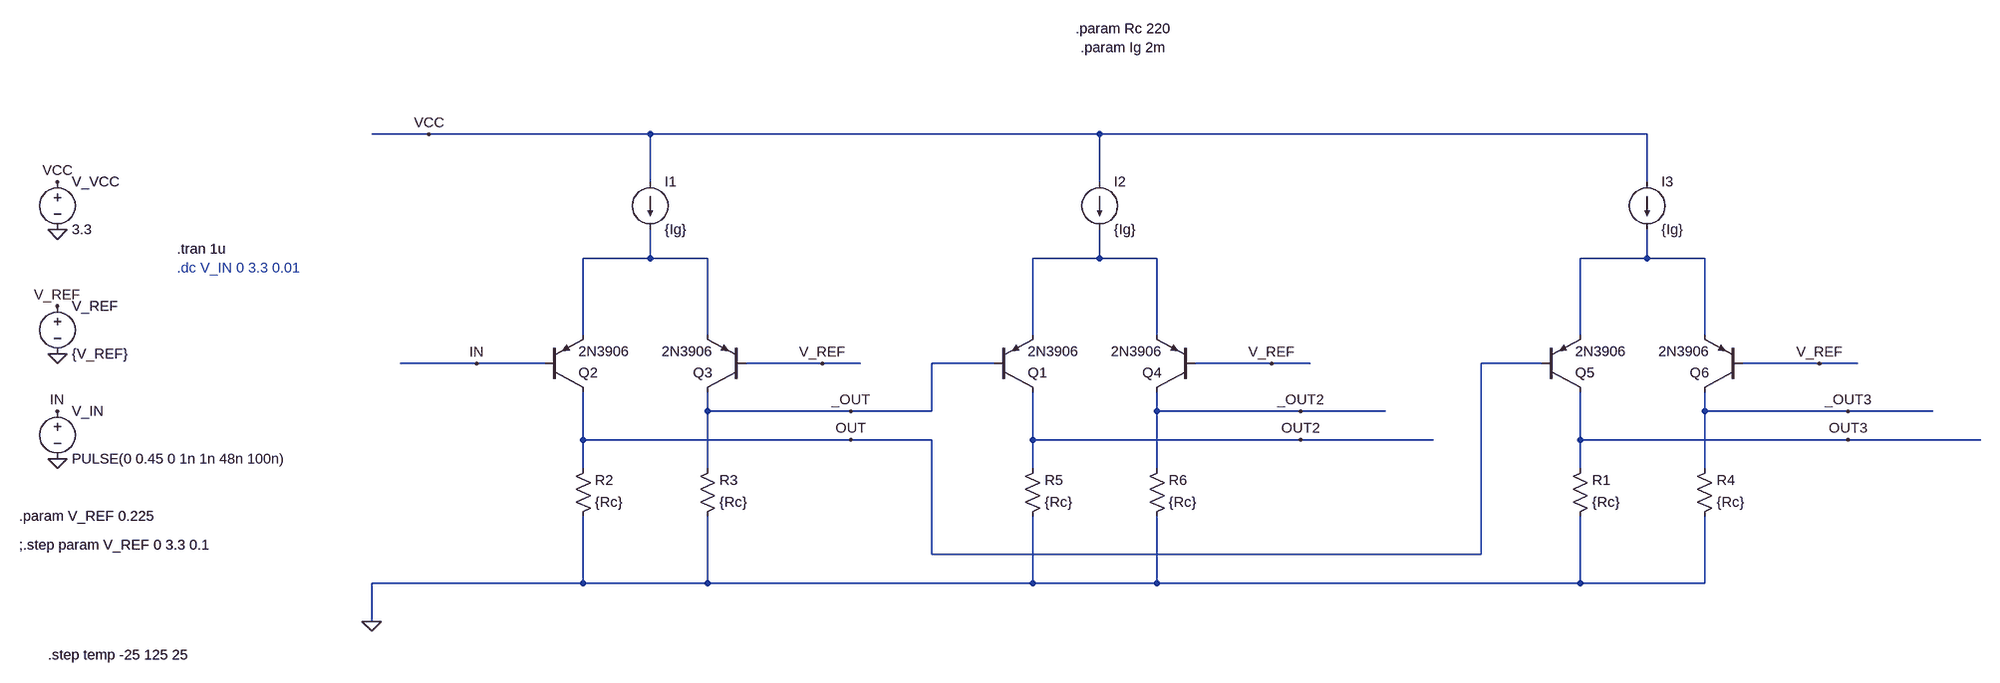
[diagram p0: schematic bm2ecl_gates.asc]
bm2ecl_gates.asc, the LTspice schematic file:
Version 4
SHEET 1 4180 740
WIRE -224 -352 -320 -352
WIRE 176 -352 -224 -352
WIRE 1168 -352 176 -352
WIRE 2144 -352 1168 -352
WIRE 176 -272 176 -352
WIRE 1168 -272 1168 -352
WIRE 2144 -272 2144 -352
WIRE 176 -144 176 -192
WIRE 176 -144 64 -144
WIRE 272 -144 176 -144
WIRE 1168 -144 1168 -192
WIRE 1168 -144 1056 -144
WIRE 1264 -144 1168 -144
WIRE 2144 -144 2144 -192
WIRE 2144 -144 2032 -144
WIRE 2240 -144 2144 -144
WIRE 64 -16 64 -144
WIRE 272 -16 272 -144
WIRE 1056 -16 1056 -144
WIRE 1264 -16 1264 -144
WIRE 2032 -16 2032 -144
WIRE 2240 -16 2240 -144
WIRE -144 32 -272 32
WIRE 0 32 -144 32
WIRE 464 32 336 32
WIRE 528 32 464 32
WIRE 992 32 832 32
WIRE 1456 32 1328 32
WIRE 1520 32 1456 32
WIRE 1968 32 1808 32
WIRE 2432 32 2304 32
WIRE 2496 32 2432 32
WIRE 272 112 272 80
WIRE 512 112 272 112
WIRE 832 112 832 32
WIRE 832 112 512 112
WIRE 1264 112 1264 80
WIRE 1504 112 1264 112
WIRE 1648 112 1504 112
WIRE 2240 112 2240 80
WIRE 2480 112 2240 112
WIRE 2624 112 2480 112
WIRE 64 160 64 80
WIRE 512 160 64 160
WIRE 832 160 512 160
WIRE 1056 160 1056 80
WIRE 1504 160 1056 160
WIRE 1728 160 1504 160
WIRE 2032 160 2032 80
WIRE 2480 160 2032 160
WIRE 2704 160 2480 160
WIRE 64 208 64 160
WIRE 272 208 272 112
WIRE 1056 208 1056 160
WIRE 1264 208 1264 112
WIRE 2032 208 2032 160
WIRE 2240 208 2240 112
WIRE 832 352 832 160
WIRE 1808 352 1808 32
WIRE 1808 352 832 352
WIRE 64 400 64 288
WIRE 64 400 -320 400
WIRE 272 400 272 288
WIRE 272 400 64 400
WIRE 1056 400 1056 288
WIRE 1056 400 272 400
WIRE 1264 400 1264 288
WIRE 1264 400 1056 400
WIRE 2032 400 2032 288
WIRE 2032 400 1264 400
WIRE 2240 400 2240 288
WIRE 2240 400 2032 400
WIRE -320 464 -320 400
FLAG -944 -192 0
FLAG -944 192 0
FLAG -944 16 0
FLAG -944 -272 VCC
FLAG -224 -352 VCC
FLAG -144 32 IN
FLAG 512 160 OUT
FLAG 512 112 _OUT
FLAG 464 32 V_REF
FLAG -944 -64 V_REF
FLAG 1504 160 OUT2
FLAG 1504 112 _OUT2
FLAG 1456 32 V_REF
FLAG -944 112 IN
FLAG -320 464 0
FLAG 2480 160 OUT3
FLAG 2480 112 _OUT3
FLAG 2432 32 V_REF
SYMBOL res 48 304 M180
WINDOW 0 36 76 Left 2
WINDOW 3 36 40 Left 2
SYMATTR InstName R2
SYMATTR Value {Rc}
SYMBOL res 256 304 M180
WINDOW 0 36 76 Left 2
WINDOW 3 36 40 Left 2
SYMATTR InstName R3
SYMATTR Value {Rc}
SYMBOL voltage -944 96 R0
WINDOW 123 0 0 Left 0
WINDOW 39 0 0 Left 0
SYMATTR InstName V_IN
SYMATTR Value PULSE(0 0.45 0 1n 1n 48n 100n)
SYMBOL voltage -944 -80 R0
SYMATTR InstName V_REF
SYMATTR Value {V_REF}
SYMBOL voltage -944 -288 R0
SYMATTR InstName V_VCC
SYMATTR Value 3.3
SYMBOL res 1040 304 M180
WINDOW 0 36 76 Left 2
WINDOW 3 36 40 Left 2
SYMATTR InstName R5
SYMATTR Value {Rc}
SYMBOL res 1248 304 M180
WINDOW 0 36 76 Left 2
WINDOW 3 36 40 Left 2
SYMATTR InstName R6
SYMATTR Value {Rc}
SYMBOL pnp 0 80 M180
SYMATTR InstName Q2
SYMATTR Value 2N3906
SYMBOL pnp 336 80 R180
SYMATTR InstName Q3
SYMATTR Value 2N3906
SYMBOL current 176 -272 R0
SYMATTR InstName I1
SYMATTR Value {Ig}
SYMBOL current 1168 -272 R0
SYMATTR InstName I2
SYMATTR Value {Ig}
SYMBOL pnp 992 80 M180
SYMATTR InstName Q1
SYMATTR Value 2N3906
SYMBOL pnp 1328 80 R180
SYMATTR InstName Q4
SYMATTR Value 2N3906
SYMBOL res 2016 304 M180
WINDOW 0 36 76 Left 2
WINDOW 3 36 40 Left 2
SYMATTR InstName R1
SYMATTR Value {Rc}
SYMBOL res 2224 304 M180
WINDOW 0 36 76 Left 2
WINDOW 3 36 40 Left 2
SYMATTR InstName R4
SYMATTR Value {Rc}
SYMBOL current 2144 -272 R0
SYMATTR InstName I3
SYMATTR Value {Ig}
SYMBOL pnp 1968 80 M180
SYMATTR InstName Q5
SYMATTR Value 2N3906
SYMBOL pnp 2304 80 R180
SYMATTR InstName Q6
SYMATTR Value 2N3906
TEXT -744 -128 Left 2 ;.dc V_IN 0 3.3 0.01
TEXT -744 -160 Left 2 !.tran 1u
TEXT -1008 336 Left 2 !;.step param V_REF 0 3.3 0.1
TEXT -1008 288 Left 2 !.param V_REF 0.225
TEXT -960 520 Left 2 !.step temp -25 125 25
TEXT 1128 -696 Left 2 !.param Rc 220
TEXT 1136 -664 Left 2 !.param Ig 2m

The netlist it stands for:
* bm2ecl_gates.asc
R2 0 OUT {Rc}
R3 0 _OUT {Rc}
V_IN IN 0 PULSE(0 0.45 0 1n 1n 48n 100n)
V_REF V_REF 0 {V_REF}
V_VCC VCC 0 3.3
R5 0 OUT2 {Rc}
R6 0 _OUT2 {Rc}
Q2 OUT IN N001 0 2N3906
Q3 _OUT V_REF N001 0 2N3906
I1 VCC N001 {Ig}
I2 VCC N002 {Ig}
Q1 OUT2 _OUT N002 0 2N3906
Q4 _OUT2 V_REF N002 0 2N3906
R1 0 OUT3 {Rc}
R4 0 _OUT3 {Rc}
I3 VCC N003 {Ig}
Q5 OUT3 OUT N003 0 2N3906
Q6 _OUT3 V_REF N003 0 2N3906
.model NPN NPN
.model PNP PNP
.lib standard.bjt
* .dc V_IN 0 3.3 0.01
.tran 1u
;.step param V_REF 0 3.3 0.1
.param V_REF 0.225
.step temp -25 125 25
.param Rc 220
.param Ig 2m
.backanno
.end